# EAGLE design esp32-hanover-flipdot (EAGLE 9.6.1)
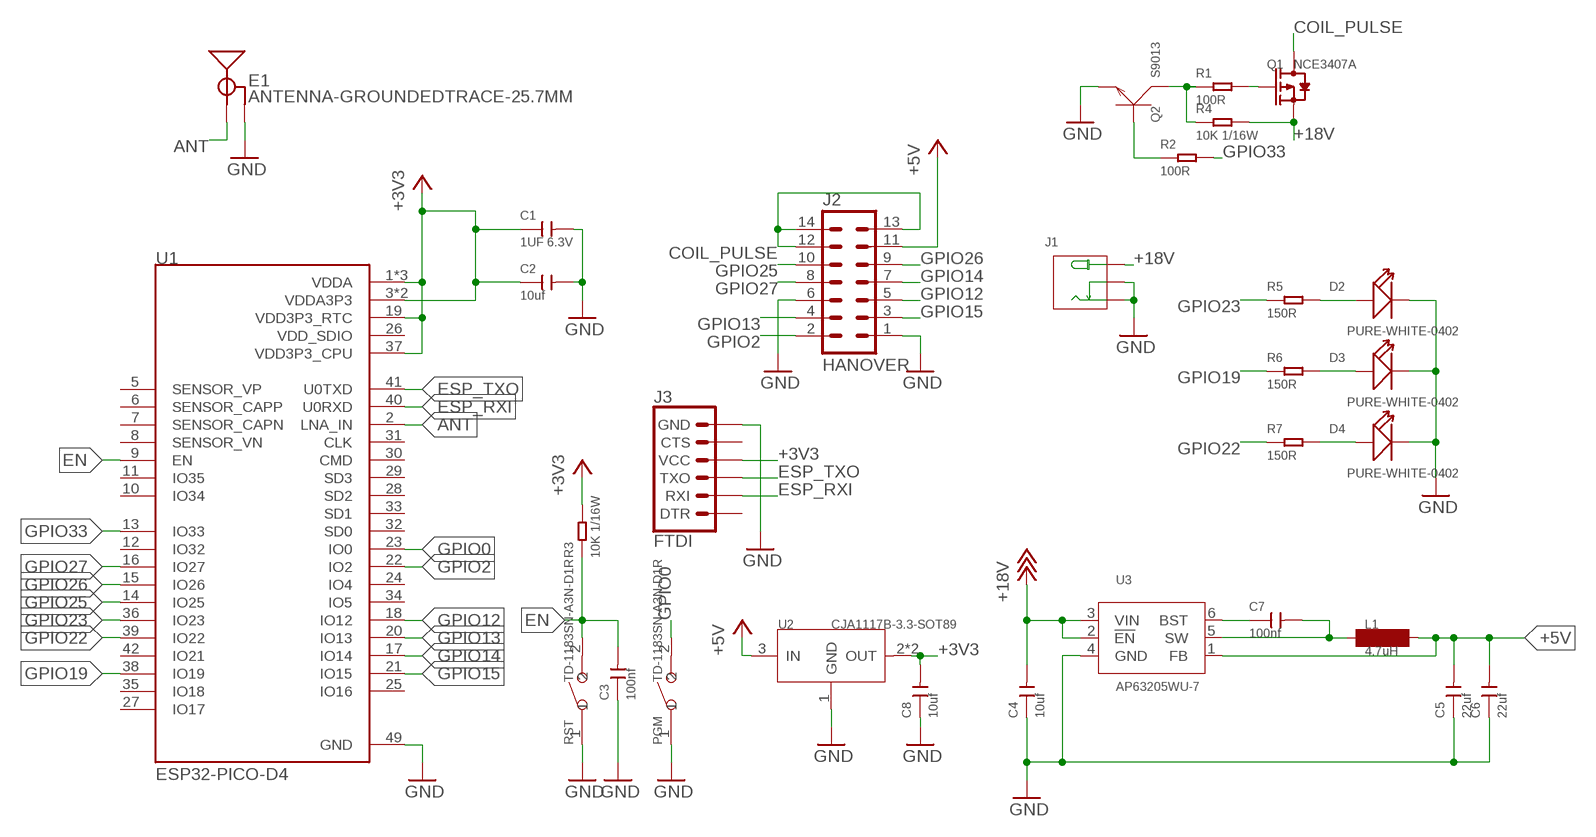
[diagram p0: schematic, sheet 1]

## Parts
C1  1UF 6.3V  CERAMIC-1UF-6.3V-10%-X5R(0402)  [C0402]
C2  10uf  CERAMIC-10UF-6.3V-20%-X5R(0402)  [C0402]
C3  100nf  CERAMIC-100NF-25V-10%-X7R(0402)  [C0402]
C4  10uf  CERAMIC-10UF-25V-10%-X5R(0805)  [C0805]
C5  22uf  CERAMIC-22UF-6.3V-20%-X5R(0805)  [C0805]
C6  22uf  CERAMIC-22UF-6.3V-20%-X5R(0805)  [C0805]
C7  100nf  CERAMIC-100NF-25V-10%-X7R(0402)  [C0402]
C8  10uf  CERAMIC-10UF-6.3V-20%-X5R(0402)  [C0402]
D2  PURE-WHITE-0402  SMD-LED-YELLOW-DIFFUSED-PURE-WHITE(0402)  [LED-0402]
D3  PURE-WHITE-0402  SMD-LED-YELLOW-DIFFUSED-PURE-WHITE(0402)  [LED-0402]
D4  PURE-WHITE-0402  SMD-LED-YELLOW-DIFFUSED-PURE-WHITE(0402)  [LED-0402]
E1  ANTENNA-GROUNDEDTRACE-25.7MM  [TRACE_ANTENNA_2.4GHZ_25.7MM]
J1  DC-005  JACK-DC-005'DC-005'  [3P-L14.2*W11.0*H9.0MM]
J2  HANOVER  ML14  [ML14]
J3  FTDI  6_PIN_SERIAL_TARGETSILK  [6_PIN_SERIAL_TARGET_SIDE_W_SILK]
L1  4.7uH  VLS201610HBX-4R7M-1  [INDC2016X100N]
PGM  TD-1183SN-A3N-D1R  SMD-BUTTON(2P-3.0X2.5X1.2+0.4MM)-B3U-1000P-2P-SMD  [SW2-2.6-3.0X2.5X1.2+0.4MM]
Q1  NCE3407A  SMD-MOSFET-P-CH-VDC=30V-ID=4.3A-NCE3407A(SOT-23)  [SOT-23]
Q2  S9013  SMD-TRANSISTORS-NPN-25V-500MA-S9013(SOT-23)  [SOT-23]
R1  100R  SMD-RES-100R-5%-1/16W(0402)  [R0402]
R2  100R  SMD-RES-100R-5%-1/16W(0402)  [R0402]
R3  10K 1/16W  SMD-RES-10K-1%-1/16W(0402)  [R0402]
R4  10K 1/16W  SMD-RES-10K-1%-1/16W(0402)  [R0402]
R5  150R  SMD-RES-150R-1%-1/16W(0402)  [R0402]
R6  150R  SMD-RES-150R-1%-1/16W(0402)  [R0402]
R7  150R  SMD-RES-150R-1%-1/16W(0402)  [R0402]
RST  TD-1183SN-A3N-D1R  SMD-BUTTON(2P-3.0X2.5X1.2+0.4MM)-B3U-1000P-2P-SMD  [SW2-2.6-3.0X2.5X1.2+0.4MM]
U1  ESP32-PICO-D4  [PQFN50P700X700X104-49N]
U2  CJA1117B-3.3-SOT89  PMIC-CJA1117B-3.3(SOT-89)  [SOT-89]
U3  AP63205WU-7  [SOT95P280X100-6N]

## Nets
+3V3: C1.1 C2.1 C8.2 J3.P$4(VCC) R3.2 U1.1(VDDA) U1.3(VDDA3P3) U1.4(VDDA3P3) U1.19(VDD3P3_RTC) U1.37(VDD3P3_CPU) U1.43(VDDA) U1.46(VDDA) U2.2(OUT) U2.4(OUT)
+5V [power]: C5.2 C6.2 J2.11 L1.2 U2.3(IN) U3.1(FB)
+18V [power]: C4.2 J1.+B(+) J1.+T(+) Q1.2(S) R4.2 U3.2(!EN) U3.3(VIN)
ANT: E1.ANT(SIGNAL) U1.2(LNA_IN)
COIL_PULSE: J2.12 J2.13 J2.14 Q1.3(D)
EN: C3.2 R3.1 RST.2 U1.9(EN)
ESP_RXI: J3.P$3(RXI) U1.40(U0RXD)
ESP_TXO: J3.P$2(TXO) U1.41(U0TXD)
GND: C1.2 C2.2 C3.1 C4.1 C5.1 C6.1 C8.1 D2.- D3.- D4.- E1.GND E1.GND2(GND) J1.-1B(-) J1.-1T(-) J1.-2B(CDN) J1.-2T(CDN) J2.1 J2.6 J3.P$6(GND) PGM.1 Q2.2(E) RST.1 U1.49(GND) U2.1(GND) U3.4(GND)
GPIO0: PGM.2 U1.23(IO0)
GPIO2: J2.2 U1.22(IO2)
GPIO12: J2.5 U1.18(IO12)
GPIO13: J2.4 U1.20(IO13)
GPIO14: J2.7 U1.17(IO14)
GPIO15: J2.3 U1.21(IO15)
GPIO19: R6.1 U1.38(IO19)
GPIO22: R7.1 U1.39(IO22)
GPIO23: R5.1 U1.36(IO23)
GPIO25: J2.10 U1.14(IO25)
GPIO26: J2.9 U1.15(IO26)
GPIO27: J2.8 U1.16(IO27)
GPIO33: R2.2 U1.13(IO33)
N$1: Q1.1(G) R1.2
N$2: Q2.3(C) R1.1 R4.1
N$3: Q2.1(B) R2.1
N$4: C7.1 U3.6(BST)
N$5: D2.+ R5.2
N$6: D3.+ R6.2
N$7: D4.+ R7.2
N$8: C7.2 L1.1 U3.5(SW)
Unconnected: J3.P$1(DTR) J3.P$5(CTS) U1.5(SENSOR_VP) U1.6(SENSOR_CAPP) U1.7(SENSOR_CAPN) U1.8(SENSOR_VN) U1.10(IO34) U1.11(IO35) U1.12(IO32) U1.24(IO4) U1.25(IO16) U1.27(IO17) U1.28(SD2) U1.29(SD3) U1.30(CMD) U1.31(CLK) U1.32(SD0) U1.33(SD1) U1.34(IO5) U1.35(IO18) U1.42(IO21)

## Power pins joined to a net without a drawn wire
VDD_SDIO: U1.26(VDD_SDIO)

## Library data of the parts
C1 = OPL_Capacitor:CERAMIC-1UF-6.3V-10%-X5R(0402): 302010003; MPN: CC0402KRX5R5BB105
C2 C8 = OPL_Capacitor:CERAMIC-10UF-6.3V-20%-X5R(0402): 302010053; MPN: CC0402MRX5R5BB106
C3 C7 = OPL_Capacitor:CERAMIC-100NF-25V-10%-X7R(0402): 302010024; MPN: CC0402KRX7R8BB104
C4 = OPL_Capacitor_No_Thermals:CERAMIC-10UF-25V-10%-X5R(0805): 302010178; MPN: CC0805KKX5R8BB106
C5 C6 = OPL_Capacitor_No_Thermals:CERAMIC-22UF-6.3V-20%-X5R(0805): 302010171; MPN: CC0805MKX5R5BB226
D2-D4 = OPL_Optoelectronics:SMD-LED-YELLOW-DIFFUSED-PURE-WHITE(0402): 304090016; MPN: 16-219A/T2D-AR2T1QY/3T
E1 = SparkFun-RF-GND-Extended:ANTENNA-GROUNDED: Antenna w/ Ground Connection 2.4GHz antennae with signal and ground terminals. TRACE_ANTENNA_2.4GHZ_15.2MM - Meander Trace antenna 15.2 x 5.7mm footprint Based on layout from TI app note AN043 <http://www.ti.com/lit/an/swra117d/swra117d.pdf>. TRACE_ANTENNA_2.4GHZ_25.7MM - Inverted F trace antenna 25.7 x 7.5 mm footprint. Based on layout from TI design note DN0007 <http://www.ti.com/lit/an/swru120b/swru120b.pdf>.
J1 = OPL_Connector_DC-005_No_Polarity_Markings:JACK-DC-005: Seeed SKU 320120003 - DIP Black DC Jack 2.1MM MPN: DC-005 Important Notes: This part requires milling slots. Please make sure layer 46 Milling is included in the profile or outline layer when exporting Gerber files. Alternatively, you can use the built-in Seeed Fusion CAM file. Find it under Third-Party CAM files. Seeed Fusion PCBA OPL <https://www.seeedstudio.com/opl.html> Order PCB/PCBA Now <https://www.seeedstudio.com/fusion_pcb.html> www.seeedstudio.com
J2 = con-harting-ml:ML14: HARTING; OC_FARNELL: unknown; OC_NEWARK: unknown
J3 = SparkFun-Connectors:6_PIN_SERIAL_TARGET: 6-pin header connection for use with the "FTDI BASIC" pinout - TARGET SIDE. Also known as "Arduino Serial Program Header". It is used to mate with our FTDI Basic serial programmers using the Arduino IDE. Note, this device has "TARGET" in the name. It is intended to be used on a design that contains a target micro-controller that you wish to program. The "sister" device, named "CABLE" is inteneded to be used on a design that usually lives on the end of your USB cable and prvides the converter chip (FTDI232 or FTDI231x) to commnicate serial RX/TX. You can populate with some of these: Break Away Headers - Straight <https://www.sparkfun.com/products/116> (PRT-00116) For reference (or to suit your programming needs) check out these designs: SparkFun FTDI Basic Breakout - 5V <https://www.sparkfun.com/products/9716> (DEV-09716) SparkFun FTDI Basic Breakout - 3.3V <https://www.sparkfun.com/products/9873> (DEV-09873) SparkFun FTDI SmartBasic <https://www.sparkfun.com/products/12935> (DEV-12935) SparkFun Beefy 3 - FTDI Basic Breakout <https://www.sparkfun.com/products/13746> (DEV-13746)
L1 = TDK VLS201610HBX-1:VLS201610HBX: VLS-HBX-1 series Inductors for power circuits Wound metal; HEIGHT: 1.0mm; TOLERANCE: 20%
PGM RST = OPL_Switch:SMD-BUTTON(2P-3.0X2.5X1.2+0.4MM): 311020047; MPN: B3U-1000P-2P-SMD; VALUE: B3U-1000P-2P-SMD
Q1 = OPL_Discrete_Semiconductor:SMD-MOSFET-P-CH-VDC=30V-ID=4.3A-NCE3407A(SOT-23): 305030010; MPN: NCE3407A
Q2 = OPL_Discrete_Semiconductor:SMD-TRANSISTORS-NPN-25V-500MA-S9013(SOT-23): 305010018; MPN: S9013
R1 R2 = OPL_Resistor:SMD-RES-100R-5%-1/16W(0402): 301012008; MPN: RC0402JR-07100RL
R3 R4 = OPL_Resistor:SMD-RES-10K-1%-1/16W(0402): 301010047; MPN: RC0402FR-0710KL
R5-R7 = OPL_Resistor:SMD-RES-150R-1%-1/16W(0402): 301011984; MPN: RC0402FR-07150RL; VALUE: 0R
U1 = ESP32-PICO-D4:ESP32-PICO-D4: The ESP32-PICO-D4 is a System-in-Package (SIP) module that is based on ESP32, providing complete Wi-Fi and Bluetooth functionalities. The module has a size as small as 7.0±0.1 mm×7.0±0.1 mm×0.94±0.1 mm, thus requiring minimal PCB area. The module integrates a 4-MB SPI flash; DESCRIPTION: WIFi/Bluetooth SIP; MF: Espressif Systems; MP: ESP32-PICO-D4; PACKAGE: SMD-48 Espressif Systems
U2 = OPL_IC:PMIC-CJA1117B-3.3(SOT-89): 310030095; MPN: CJA1117B-3.3
U3 = Diodes_Inc_AP6320:AP6320: AP6320 Synchronous Buck Converters Diodes' buck converters provide ultra-low IQ solution with best-in-class EMI performance Diodes' AP63200, AP63201, AP63203, and AP63205 are 2 A synchronous buck converters with a wide input voltage range of 3.8 V to 32 V supporting 5 V, 12 V, and 24 V power supplies. Integrated 125 mΩ high-side and a 68 mΩ low-side power MOSFETs provide high-efficiency step-down DC-DC conversion. The AP63200, AP63203, and AP63205 utilize pulse frequency modulation (PFM) with an ultra-low quiescent current of 22 µA, which provides efficiencies up to 80% and 88% during light load conditions of 1 mA and 5 mA, respectively. The AP63203 and AP63205 are fixed output buck converters with optimized design for reduced electromagnetic interference (EMI). The AP63201 operates in pulse width modulation (PWM) where the switching frequency is relatively fixed regardless of output load. All members have optimized EMI, utilizing frequency spread spectrum (FSS) with a switching frequency jitter of ±6% further reduces EMI. Further EMI improvements are achieved through its proprietary gate driver scheme which reduces switching node ringing without sacrificing MOSFET turn-on and turn-off times. The device is available in a low-profile TSOT26 package.

## Net classes
0 default: width 0.152 mm, drill 0.305 mm
1 power: width 0.305 mm, drill 0.305 mm

## Board
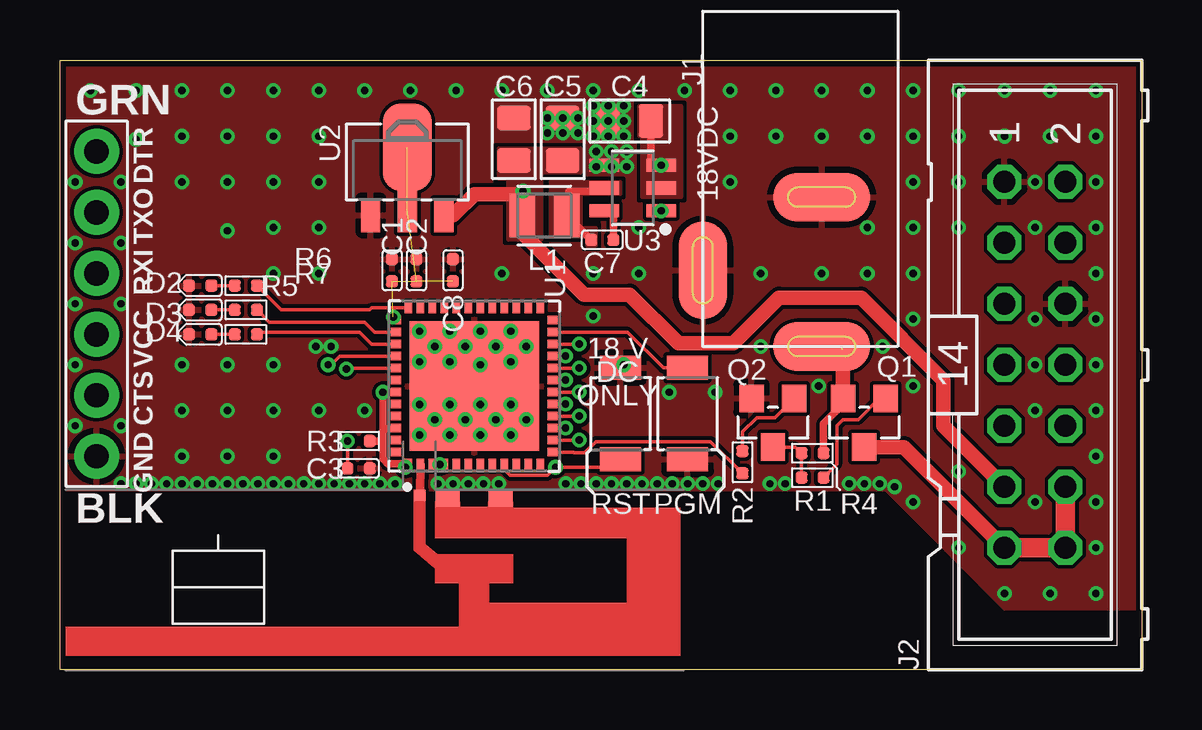
[diagram p1: board, top side]
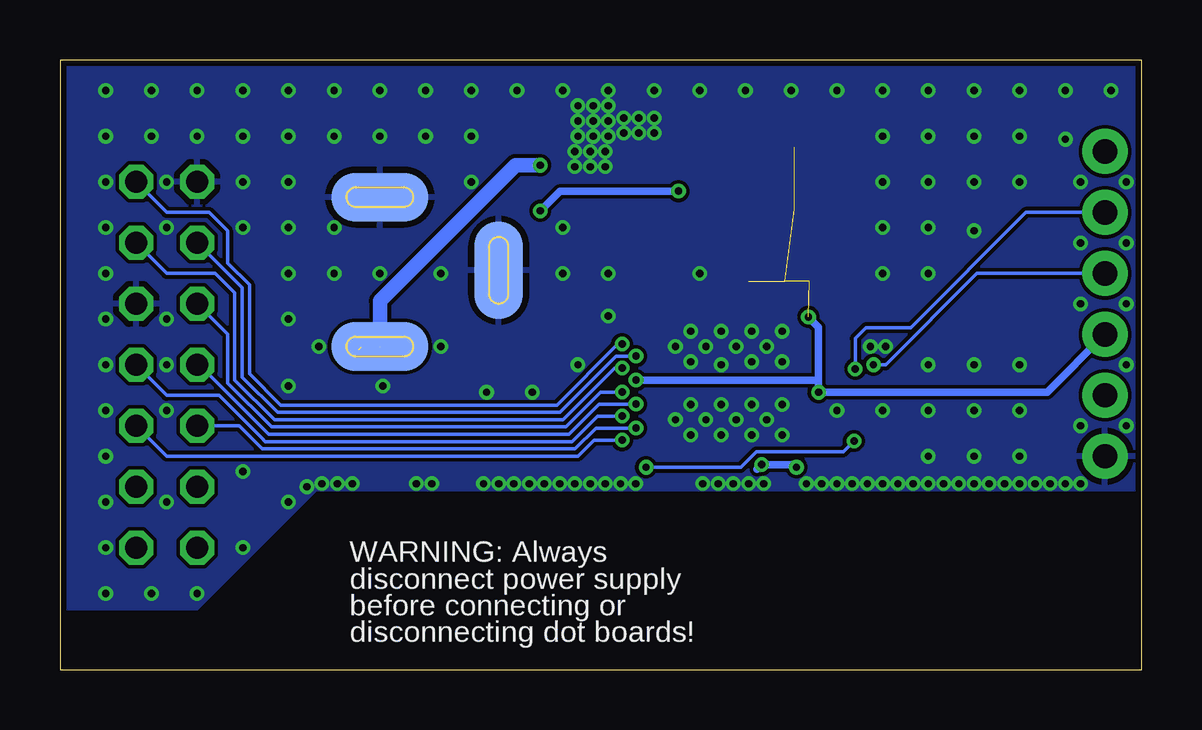
[diagram p2: board, bottom side, seen from below]

Size 45.09 x 25.4 mm. Coordinates in mm from the lower left corner, seen from the top.
Outline: 0,0 0,25.4 45.09,25.4 45.09,0 0,0
Copper layers (1*16): Top 0.035mm / dielectric 1.5mm / Bottom 0.035mm
Design rules "SeeedStudio_2layer_DRU_no_angle_20140221": minimum track width 6mil, minimum drill 12mil, track to track 6mil, track to pad 6mil, pad to pad 6mil, via to via 6mil, smd to smd 0mil, copper to edge 10mil, drill to drill 10mil, minimum pad ring 10mil, minimum via ring 6mil, stop-mask expansion 2mil, vias tented up to drill 100mil, thermal gap 10mil

### Footprints (pad centres in the part's own frame; a part is rotated, then mirrored left to right if it is on the bottom)
C0402 = smd 0.5 x 0.5: 1 0,0.463; 2 0,-0.463
C0805 = smd 1.397 x 1.016: 1 0,0.889; 2 0,-0.889
LED-0402 = smd 0.5 x 0.5: + -0.463,0; - 0.463,0
TRACE_ANTENNA_2.4GHZ_25.7MM = smd 0.46 x 0.46: ANT 0,0.23 | smd 1 x 0.714: GND -1.18,0.357; GND2 -3.38,0.357
3P-L14.2*W11.0*H9.0MM = smd 2.032 x 4.064 bottom: +B 3.175,0; -1B -3.048,0 | smd 2.032 x 4.064: +T 3.175,0; -1T -3.048,0 | smd 4.064 x 2.032 bottom: -2B 0,-4.953 | smd 4.064 x 2.032: -2T 0,-4.953
ML14 = drill 0.914 octagon: 1 -7.62,-1.27; 2 -7.62,1.27; 3 -5.08,-1.27; 4 -5.08,1.27; 5 -2.54,-1.27; 6 -2.54,1.27; 7 0,-1.27; 8 0,1.27; 9 2.54,-1.27; 10 2.54,1.27; 11 5.08,-1.27; 12 5.08,1.27; 13 7.62,-1.27; 14 7.62,1.27
6_PIN_SERIAL_TARGET_SIDE_W_SILK = drill 1.016 pad 1.88: P$1 -6.35,0; P$2 -3.81,0; P$3 -1.27,0; P$4 1.27,0; P$5 3.81,0; P$6 6.35,0
INDC2016X100N = smd 1.067 x 1.817: 1 -0.925,0; 2 0.925,0
SW2-2.6-3.0X2.5X1.2+0.4MM = smd 1 x 1.7: 1 -1.9,0; 2 1.9,0
SOT-23 = smd 1.016 x 1.143: 1 -0.889,-1.016; 2 0.889,-1.016; 3 0,1.016
R0402 = smd 0.5 x 0.5: 1 0,0.463; 2 0,-0.463
PQFN50P700X700X104-49N = smd 0.45 x 0.35: 1 -3.265,2.75; 2 -3.265,2.25; 3 -3.265,1.75; 4 -3.265,1.25; 5 -3.265,0.75; 6 -3.265,0.25; 7 -3.265,-0.25; 8 -3.265,-0.75; 9 -3.265,-1.25; 10 -3.265,-1.75; 11 -3.265,-2.25; 12 -3.265,-2.75; 25 3.265,-2.75; 26 3.265,-2.25; 27 3.265,-1.75; 28 3.265,-1.25; 29 3.265,-0.75; 30 3.265,-0.25; 31 3.265,0.25; 32 3.265,0.75; 33 3.265,1.25; 34 3.265,1.75; 35 3.265,2.25; 36 3.265,2.75 | smd 0.35 x 0.45: 13 -2.75,-3.265; 14 -2.25,-3.265; 15 -1.75,-3.265; 16 -1.25,-3.265; 17 -0.75,-3.265; 18 -0.25,-3.265; 19 0.25,-3.265; 20 0.75,-3.265; 21 1.25,-3.265; 22 1.75,-3.265; 23 2.25,-3.265; 24 2.75,-3.265; 37 2.75,3.265; 38 2.25,3.265; 39 1.75,3.265; 40 1.25,3.265; 41 0.75,3.265; 42 0.25,3.265; 43 -0.25,3.265; 44 -0.75,3.265; 45 -1.25,3.265; 46 -1.75,3.265; 47 -2.25,3.265; 48 -2.75,3.265 | smd 5.4 x 5.4: 49 0,0
SOT-89 = smd 0.8 x 1.4: 1 -1.524,-1.905; 3 1.524,-1.905 | smd 0.8 x 1.9: 2 0,-1.651 | smd 2.032 x 3.65: 4 0,0.94
SOT95P280X100-6N = smd 1.237 x 0.547: 1 -1.187,0.95; 2 -1.187,0; 3 -1.187,-0.95; 4 1.187,-0.95; 5 1.187,0; 6 1.187,0.95

### Placement (x,y rotation side)
C1  13.84,16.64 180 top
C2  14.86,16.64 180 top
C3  12.45,8.38 270 top
C4  23.75,22.86 90 top
C5  20.95,22.1 0 top
C6  18.92,22.1 0 top
C7  22.61,17.91 270 top
C8  16.38,16.64 0 top
D2  5.84,16 180 top
D3  5.84,14.99 180 top
D4  5.84,13.97 180 top
E1  14.99,7.49 180 top
J1  31.75,16.64 270 top
J2  40.64,12.7 270 top
J3  1.52,15.24 270 top
L1  20.19,18.92 180 top
PGM  26.16,10.67 90 top
Q1  33.53,10.29 180 top
Q2  29.72,10.29 180 top
R1  31.37,8 90 top
R2  28.45,8.64 0 top
R3  12.45,9.53 90 top
R4  31.37,9.02 90 top
R5  7.75,16 270 top
R6  7.75,14.99 270 top
R7  7.75,13.97 270 top
RST  23.37,10.67 270 top
U1  17.27,11.81 90 top
U2  14.48,20.83 0 top
U3  23.88,20.07 180 top

### Tracks (layer width: path | path; a pad name or v marks a point on that pad's centre or on a via)
+3V3  (via drill 0.3)  (5 unrouted)
  Top 0.305: v21.07,12.06 U1.19 | U1.43 v13.47,11.56 v13.46,11.56 v13.47,11.55 13.47,10.04 | U1.1 14.49,8.58 14.39,8.58 | 14.39,8.58 13.66,8.58 13.47,8.78 13.47,9.53 | U1.46 13.99,10.04 13.47,10.04 | 14.39,8.58 v14.39,8.43 | U1.37 13.89,14.68 v13.89,14.69 | 13.47,10.04 13.47,9.53 | 13.47,9.53 R3.2 | U1.4 v15.84,8.54 U1.3
  Bottom 0.305: v14.39,8.43 14.5,8.54 v15.84,8.54 16.02,8.36 | v13.89,14.69 13.46,14.27 13.46,12.06 | 13.46,12.06 v13.46,11.56 3.94,11.56 J3.P$4 | v21.07,12.06 13.47,12.06 13.46,12.06
+5V  (via drill 0.3)
  Top 0.61: v19.3,19.94 19.18,19.81 17.27,19.81 16.38,18.92 U2.3 | 19.39,18.8 L1.2 19.27,18.2 21.84,15.62 23.75,15.62 25.78,13.59 28.07,13.59 29.97,15.49 33.4,15.49 36.83,12.06 36.83,10.16 J2.11
  Bottom 0.305: v19.3,19.94 24.24,19.94 U3.1
  other vias: 25.06,19.12
  pour Top: 20.07,17.91 18.67,17.91 18.67,20.45 18.29,20.45 18.29,21.72 21.72,21.72 21.72,20.7 20.07,20.7
+18V  (via drill 0.3)  (2 unrouted)
  Top 0.305: U3.3 24.64,21.02 C4.2 | 32.64,11.43 Q1.2 32.64,11.05 31.83,10.24 R4.2
  Top 0.61: J1.+T 32.51,13.46 | 32.51,11.43 Q1.2 32.64,13.34
  Bottom 0.61: U3.3 26.1,21.02 31.75,15.37 J1.+T
  other vias: 25.06,21.02
  pour Top (no thermals): 24.26,19.68 25.91,19.68 25.91,23.5 24.13,23.5 24.13,22.23 24.26,22.23
ANT
  Top 0.152: U1.2 14.99,8.55
  Top 0.356: U1.2 15.02,8.16 E1.ANT
COIL_PULSE
  Top 0.61: Q1.3 35.18,9.27 J2.13
  Top 0.813: J2.12 J2.14 J2.13
EN  (via drill 0.3)  (1 unrouted)
  Top 0.152: U1.9 18.62,8.45 18.62,8.24 18.76,8.09 20.32,8.09 v20.65,8.43 23.03,8.43 RST.2 | R3.1 C3.2
  Bottom 0.152: v20.65,8.43 16.71,8.43 16.06,9.08 12.44,9.08 v11.99,9.53
ESP_RXI  (via drill 0.3)
  Top 0.152: v11.18,12.7 11.3,12.7 11.66,13.06 U1.40
  Bottom 0.152: J3.P$3 6.86,16.51 10.67,12.7 v11.18,12.7
ESP_TXO  (via drill 0.3)
  Top 0.152: U1.41 11.97,12.56 v11.94,12.53
  Bottom 0.152: v11.94,12.53 11.94,13.8 11.49,14.25 9.63,14.25 4.83,19.05 J3.P$2
GND  (via drill 0.3)
  other vias: 10.79,7.75 11.43,7.75 12.06,7.75 13.34,7.75 13.97,7.75 12.7,7.75 27.94,24.13 39.37,3.17 33.53,7.75 37.47,8.26 27.94,22.23 29.84,22.23 29.84,24.13 31.75,22.23 31.75,24.13 37.47,24.13 39.37,24.13 39.37,22.23 41.27,24.13 43.18,24.13 43.18,22.23 43.18,20.32 37.47,22.23 37.47,20.32 37.47,18.41 41.27,3.17 35.56,6.99 41.27,22.23 1.27,24.13 0.64,20.32 6.99,10.79 16.51,24.13 2.54,20.32 6.99,8.89 18.41,24.13 33.66,16.51 35.56,14.61 35.56,16.51 35.56,18.41 35.56,20.32 33.66,24.13 33.66,22.23 35.56,22.23 35.56,24.13 43.18,18.41 43.18,16.51 43.18,14.61 43.18,12.7 43.18,10.79 43.18,8.89 43.18,6.99 43.18,5.08 43.18,3.17 20.32,24.13 16.89,10.41 16.26,11.05 17.53,11.05 17.53,12.7 10.79,10.79 5.08,10.79 16.26,12.83 15.62,13.46 16.89,13.46 18.16,13.46 18.8,12.83 19.43,13.46 18.8,14.1 17.53,14.1 16.26,14.1 14.99,11.05 15.62,10.41 18.16,10.41 18.8,11.05 18.8,9.78 17.53,9.78 16.26,9.78 14.99,9.78 19.43,10.41 14.99,14.1 14.99,12.83 40.64,14.61 12.7,24.13 6.99,24.13 8.89,24.13 10.79,24.13 14.61,24.13 10.67,13.46 11.3,13.46 5.08,24.13 0.64,17.78 0.64,15.24 2.54,15.24 0.64,12.7 2.54,10.16 0.64,10.16 2.54,7.75 40.64,6.99 23.5,22.86 23.5,22.23 21.59,22.99 22.86,22.23 22.86,22.86 22.23,22.86 22.23,22.23 22.99,21.59 22.35,21.59 22.35,20.95 22.99,20.95 26.04,24.13 24.13,24.13 22.23,24.13 24.13,16.51 21.59,22.35 23.62,20.95 23.62,21.59 20.95,22.99 20.95,22.35 20.32,22.35 20.32,22.99 22.23,23.5 22.86,23.5 23.5,23.5 24.13,18.41 22.23,16.51 17.65,7.75 15.75,7.75 16.38,7.75 17.02,7.75 18.29,7.75 29.21,16.51 37.47,5.08 3.17,24.13 10.79,22.23 8.89,22.23 6.99,22.23 5.08,22.23 3.17,22.1 5.08,20.32 6.99,20.32 8.89,20.32 10.79,20.32 10.79,18.41 8.89,18.41 6.99,18.29 10.79,16.51 8.89,16.51 2.54,17.78 8.89,12.7 6.99,12.7 5.08,12.7 8.89,10.79 12.7,10.79 8.89,8.89 5.08,8.89 21.08,7.75 21.72,7.75 24.26,7.75 24.89,7.75 25.53,7.75 26.16,7.75 26.8,7.75 27.43,7.75 29.59,7.75 30.23,7.75 32.89,7.75 10.16,7.75 9.53,7.75 8.89,7.75 8.26,7.75 7.62,7.75 6.99,7.75 6.35,7.75 5.71,7.75 5.08,7.75 4.45,7.75 3.81,7.75 3.17,7.75 18.41,16.51 27.94,20.32 33.66,18.41 31.75,16.51 25.4,11.56 27.3,11.56 40.64,18.41 40.64,12.7 40.64,10.79 40.64,20.32 34.16,7.75 34.8,7.62 22.35,7.75 22.99,7.75 23.62,7.75 23.5,12.7 22.23,14.73 31.62,11.81 35.56,11.81 29.21,13.46 34.29,13.46
  pour Top (rank 6): 0,7.49 34.42,7.49 39.37,2.54 45.09,2.54 45.09,25.4 0,25.4
  pour Bottom (rank 6): 0,7.49 34.42,7.49 39.37,2.54 45.09,2.54 45.09,25.4 0,25.4
GPIO0
  Top 0.152: U1.23 23.65,14.06 25.15,12.57 PGM.2
GPIO2  (via drill 0.3)
  Top 0.152: U1.22 v21.65,13.56
  Bottom 0.152: J2.2 40.64,19.05 38.86,19.05 38.1,18.29 38.1,16.94 37.19,16.03 37.19,12.32 35.89,11.02 24.38,11.02 21.84,13.56 v21.65,13.56
GPIO12  (via drill 0.3)
  Top 0.152: v21.65,11.56 U1.18
  Bottom 0.152: v21.65,11.56 22.54,11.56 24,10.11 36.27,10.11 38.1,11.94 38.1,13.97 J2.5
GPIO13  (via drill 0.3)
  Top 0.152: v21.65,12.56 U1.20
  Bottom 0.152: v21.65,12.56 21.98,12.56 24.12,10.41 36.14,10.41 37.8,12.06 37.8,15.7 38.61,16.51 40.64,16.51 J2.4
GPIO14  (via drill 0.3)
  Top 0.152: v21.07,11.06 U1.17
  Bottom 0.152: v21.07,11.06 22.61,11.06 23.87,9.8 36.4,9.8 36.46,9.87 36.54,9.94 39.29,12.7 J2.7
GPIO15  (via drill 0.3)
  Top 0.152: v21.07,13.06 U1.21
  Bottom 0.152: v21.07,13.06 21.91,13.06 24.25,10.72 36.02,10.72 37.49,12.19 37.49,15.9 J2.3
GPIO19
  Top 0.152: R6.1 8.72,14.48 12.7,14.48 13.12,14.06 U1.38
GPIO22
  Top 0.152: R7.1 8.29,14.05 12.5,14.05 12.98,13.56 U1.39
GPIO23
  Top 0.152: R5.1 9.23,14.99 12.91,14.99 13,15.08 U1.36
GPIO25  (via drill 0.3)
  Top 0.152: v21.65,9.56 U1.14
  Bottom 0.152: 21.98,9.56 v21.65,9.56 22.82,9.56 23.49,8.89 40.64,8.89 J2.10
GPIO26  (via drill 0.3)
  Top 0.152: v21.07,10.06 U1.15
  Bottom 0.152: v21.07,10.06 22.75,10.06 23.62,9.2 36.65,9.2 37.62,10.16 J2.9
GPIO27  (via drill 0.3)
  Top 0.152: v21.65,10.56 U1.16
  Bottom 0.152: 21.98,10.56 v21.65,10.56 22.68,10.56 23.74,9.5 36.52,9.5 36.59,9.56 36.63,9.6 38.45,11.43 40.64,11.43 J2.8
GPIO33
  Top 0.152: 20.58,9.02 U1.13 | U1.13 20.57,9.03 | U1.13 21.4,9.06 21.43,9.03 21.87,9.03 22.34,9.5 27.12,9.5 R2.2
N$1
  Top 0.152: Q1.1 34.16,11.3 33.27,10.41 32.64,10.41 32.38,10.16 32.38,8.55 R1.2
N$2
  Top 0.152: R1.1 R4.1 30.65,9.27 Q2.3
N$3
  Top 0.152: R2.1 28.45,9.91 29.05,10.5 29.81,10.5 Q2.1
N$4
  Top 0.305: U3.6 23.07,19.12 C7.1
N$5
  Top 0.152: R5.2 D2.+
N$6
  Top 0.152: R6.2 D3.+
N$7
  Top 0.152: R7.2 D4.+
N$8
  Top 0.305: C7.2 21.25,18.8 L1.1 21.21,19.18 21.21,19.94 22.69,19.94 U3.5
  pour Top (no thermals): 23.37,20.32 20.45,20.32 20.45,18.03 21.97,18.03 21.97,17.65 22.35,17.65 22.35,18.41 21.72,18.41 21.72,19.81 23.37,19.81

### Text on the board
tNames: 18VDC | 18 V / DC / ONLY
bNames: WARNING: Always / disconnect power supply / before connecting or / disconnecting dot boards!